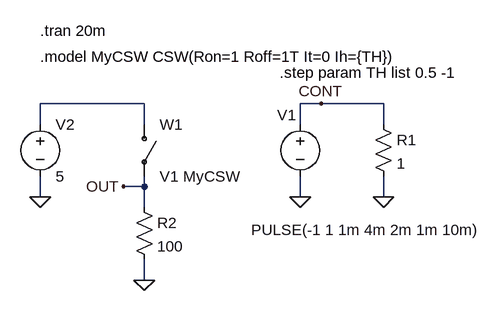
[diagram p0: schematic Fig_2-139_CSW.asc]
Fig_2-139_CSW.asc, the LTspice schematic file:
Version 4
SHEET 1 1024 680
WIRE 112 128 -48 128
WIRE 384 128 352 128
WIRE 480 128 384 128
WIRE -48 160 -48 128
WIRE 112 160 112 128
WIRE 352 160 352 128
WIRE 480 160 480 128
WIRE 112 256 112 240
WIRE 112 256 80 256
WIRE -48 272 -48 240
WIRE 352 272 352 240
WIRE 480 272 480 240
WIRE 112 288 112 256
WIRE 112 400 112 368
FLAG 352 272 0
FLAG 480 272 0
FLAG 384 128 CONT
FLAG 112 400 0
FLAG 80 256 OUT
FLAG -48 272 0
SYMBOL voltage 352 144 R0
WINDOW 0 -21 17 Bottom 2
WINDOW 3 101 163 Top 2
WINDOW 123 0 0 Left 0
WINDOW 39 60 56 VTop 2
SYMATTR InstName V1
SYMATTR Value PULSE(-1 1 1m 4m 2m 1m 10m)
SYMBOL res 464 144 R0
SYMATTR InstName R1
SYMATTR Value 1
SYMBOL csw 112 160 R0
SYMATTR InstName W1
SYMATTR Value V1 MyCSW
SYMBOL res 96 272 R0
SYMATTR InstName R2
SYMATTR Value 100
SYMBOL voltage -48 144 R0
WINDOW 123 0 0 Left 0
WINDOW 39 0 0 Left 0
SYMATTR InstName V2
SYMATTR Value 5
TEXT -48 56 Left 2 !.model MyCSW CSW(Ron=1 Roff=1T It=0 Ih={TH})
TEXT 320 80 Left 2 !.step param TH list 0.5 -1
TEXT -48 16 Left 2 !.tran 20m

The netlist it stands for:
* Fig_2-139_CSW.asc
V1 CONT 0 PULSE(-1 1 1m 4m 2m 1m 10m)
R1 CONT 0 1
W1 N001 OUT V1 MyCSW
R2 OUT 0 100
V2 N001 0 5
.model MyCSW CSW(Ron=1 Roff=1T It=0 Ih={TH})
.step param TH list 0.5 -1
.tran 20m
.backanno
.end